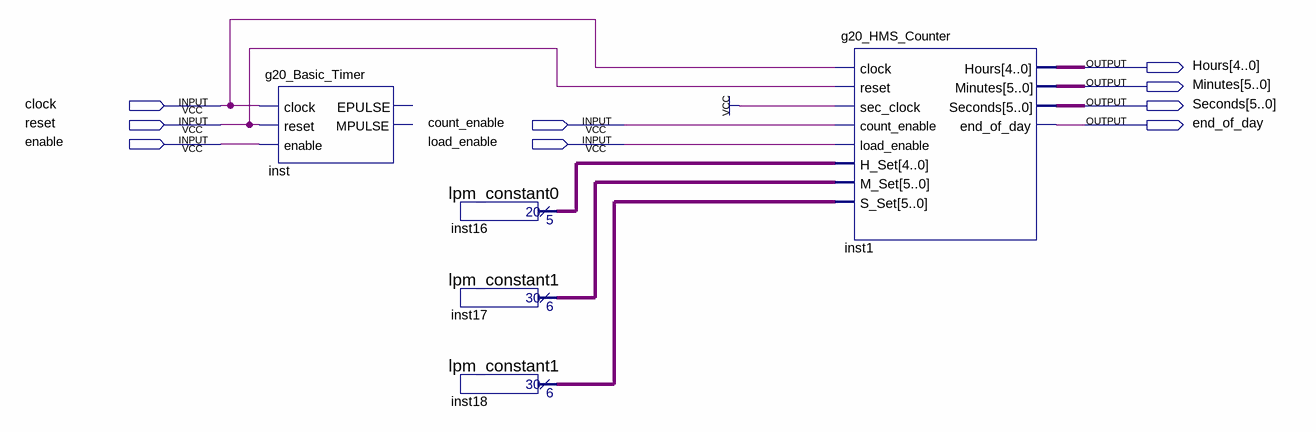
[diagram p0: schematic sheet]
// Quartus schematic HMS_Counter_g20.bdf as structural Verilog: 5 symbols, 9 pins
module HMS_Counter_g20 (
  input  clock,
  input  reset,
  input  count_enable,
  input  enable,
  input  load_enable,
  output [4:0] Hours,
  output [5:0] Minutes,
  output [5:0] Seconds,
  output end_of_day
);

  wire [4:0] inst16_result;
  wire [5:0] inst17_result, inst18_result;

  g20_Basic_Timer inst (.clock(clock), .reset(reset), .enable(enable));  // open: EPULSE, MPULSE
  lpm_constant0 inst16 (.result(inst16_result));
  lpm_constant1 inst17 (.result(inst17_result));
  lpm_constant1 inst18 (.result(inst18_result));
  g20_HMS_Counter inst1 (
    .clock(clock), .reset(reset), .sec_clock(1'b1), .count_enable(count_enable), .load_enable(load_enable),
    .H_Set(inst16_result), .M_Set(inst17_result), .S_Set(inst18_result), .Hours(Hours), .Minutes(Minutes),
    .Seconds(Seconds), .end_of_day(end_of_day));
endmodule
